# EAGLE design CP2102 breakout (EAGLE 7.3.0)
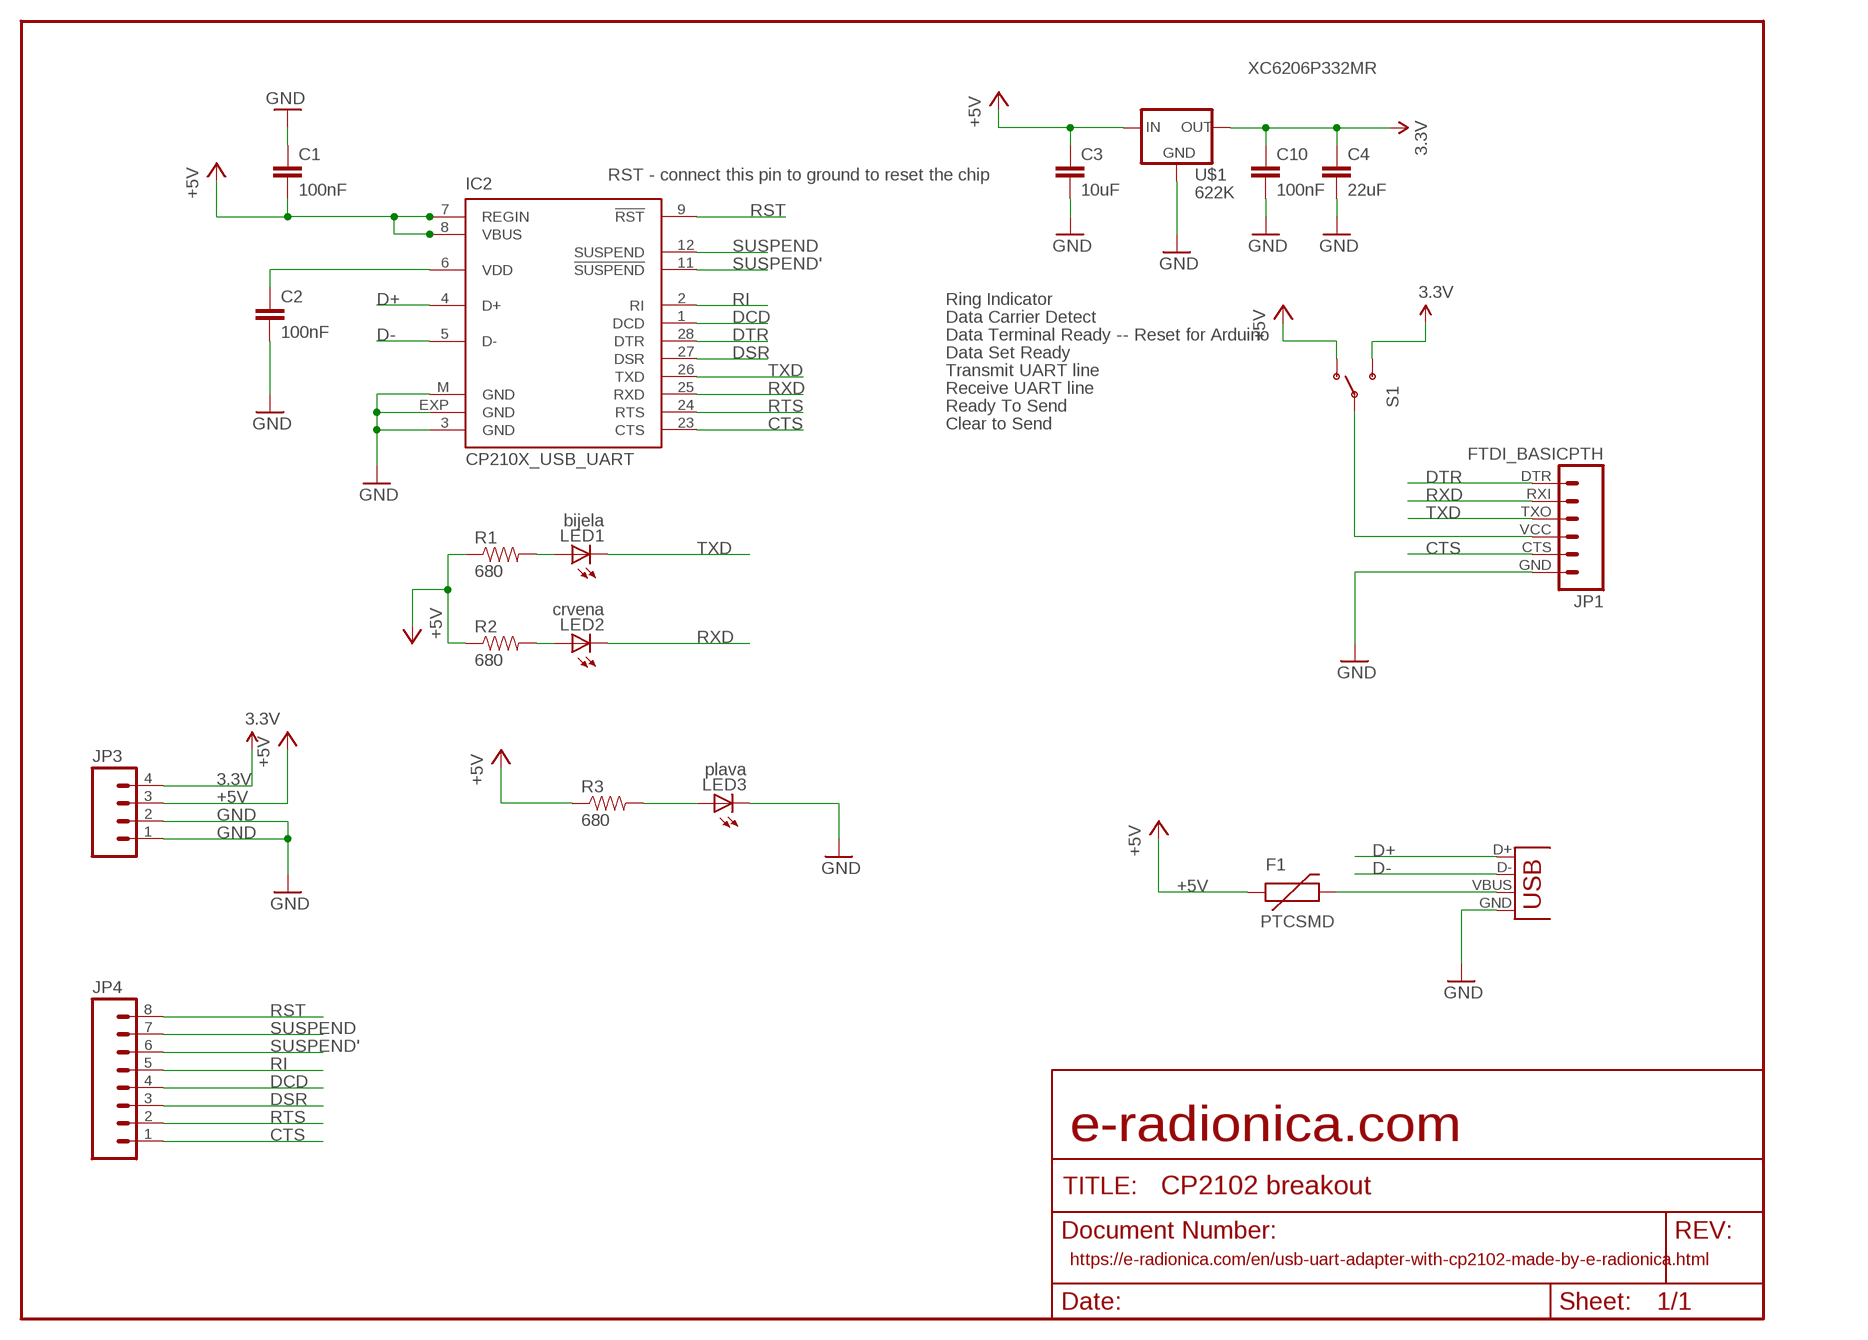
[diagram p0: schematic, sheet 1]

## Parts
C1  100nF  CAP0603-CAP  [0603-CAP]
C2  100nF  CAP0603-CAP  [0603-CAP]
C3  10uF  C-EUC3216  [C3216]
C4  22uF  C-EUC3216  [C3216]
C10  100nF  CAP0603-CAP  [0603-CAP]
F1  PTCSMD  [PTC-1206]
IC2  CP210X_USB_UART  [MLP28]
JP1  FTDI_BASICPTH  [FTDI_BASIC]
JP3  M04PTH  [1X04]
JP4  M081X08  [1X08]
LED1  bijela  LEDCHIP-LED0805  [CHIP-LED0805]
LED2  crvena  LEDCHIP-LED0805  [CHIP-LED0805]
LED3  plava  LEDCHIP-LED0805  [CHIP-LED0805]
R1  680  RESISTOR0603-RES  [0603-RES]
R2  680  RESISTOR0603-RES  [0603-RES]
R3  680  RESISTOR0603-RES  [0603-RES]
S1  SWITCH-SPST-SMD-A  [SWITCH-SPST-SMD-A]
U$1  622K  [662K]
X1  USB-MICROB  [USB-MICROB]

## Nets
3.3V: C4.1 C10.1 JP3.4 S1.3(S) U$1.OUT
+5V: C1.2 C3.1 F1.1 IC2.7(REGIN) IC2.8(VBUS) JP3.3 R1.1 R2.1 R3.1 S1.1(O) U$1.IN
CTS: IC2.23(CTS) JP1.CTS JP4.1
D+: IC2.4(D+) X1.D+
D-: IC2.5(D-) X1.D-
DCD: IC2.1(DCD) JP4.4
DSR: IC2.27(DSR) JP4.3
DTR: IC2.28(DTR) JP1.DTR
GND: C1.1 C2.2 C3.2 C4.2 C10.2 IC2.3(GND) IC2.EXP(GND) IC2.M(GND) JP1.GND JP3.1 JP3.2 LED3.C U$1.GND X1.GND
N$1: LED1.A R1.2
N$2: LED2.A R2.2
N$3: LED3.A R3.2
N$4: C2.1 IC2.6(VDD)
RI: IC2.2(RI) JP4.5
RST: IC2.9(!RST) JP4.8
RTS: IC2.24(RTS) JP4.2
RXD: IC2.25(RXD) JP1.RXI LED2.C
SUSPEND: IC2.12(SUSPEND) JP4.7
SUSPEND': IC2.11(!SUSPEND) JP4.6
TXD: IC2.26(TXD) JP1.TXO LED1.C
VBUS: F1.2 X1.VBUS
VCC: JP1.VCC S1.2(P)

## Notes on the sheet
- XC6206P332MR
- RST - connect this pin to ground to reset the chip
- Ring Indicator
- Data Carrier Detect
- Data Terminal Ready -- Reset for Arduino
- Data Set Ready
- Transmit UART line
- Receive UART line
- Ready To Send
- Clear to Send
- e-radionica.com
- https://e-radionica.com/en/usb-uart-adapter-with-cp2102-made-by-e-radionica.html

## Library data of the parts
C1 C2 C10 = SparkFun:CAP: Capacitor Standard 0603 ceramic capacitor, and 0.1" leaded capacitor.
C3 C4 = rcl:C-EU: CAPACITOR, European symbol
F1 = SparkFun:PTC: Resettable Fuse PTC Resettable Fuse. Spark Fun Electronics SKU : COM-08357
IC2 = SparkFun-DigitalIC:CP210X_USB_UART: Single-Chip USB to UART Bridge Source: www.silabs.com .. CP2101.pdf / cp2102.pdf. Spark Fun Electronics SKU : COM-00310
JP1 = SparkFun:FTDI_BASIC: FTDI Basic: 3.3V and 5V
JP3 = SparkFun:M04: Header 4 Standard 4-pin 0.1" header. Use with straight break away headers (SKU : PRT-00116), right angle break away headers (PRT-00553), swiss pins (PRT-00743), machine pins (PRT-00117), and female headers (PRT-00115). Molex polarized connector foot print use with SKU : PRT-08231 with associated crimp pins and housings. 1MM SMD Version SKU: PRT-10208
JP4 = SparkFun:M08: Header 8 Standard 8-pin 0.1" header. Use with straight break away headers (SKU : PRT-00116), right angle break away headers (PRT-00553), swiss pins (PRT-00743), machine pins (PRT-00117), and female headers (PRT-00115).
LED1-LED3 = adafruit:LED: LED OSRAM: - CHIPLED LG R971, LG N971, LY N971, LG Q971, LY Q971, LO R971, LY R971 LH N974, LH R974 LS Q976, LO Q976, LY Q976 LO Q996 - Hyper CHIPLED LW Q18S LB Q993, LB Q99A, LB R99A - SideLED LS A670, LO A670, LY A670, LG A670, LP A670 LB A673, LV A673, LT A673, LW A673 LH A674 LY A675 LS A676, LA A676, LO A676, LY A676, LW A676 LS A679, LY A679, LG A679 - Hyper Micro SIDELED® LS Y876, LA Y876, LO Y876, LY Y876 LT Y87S - SmartLED LW L88C, LW L88S LB L89C, LB L89S, LG L890 LS L89K, LO L89K, LY L89K LS L896, LA L896, LO L896, LY L896 - TOPLED LS T670, LO T670, LY T670, LG T670, LP T670 LSG T670, LSP T670, LSY T670, LOP T670, LYG T670 LG T671, LOG T671, LSG T671 LB T673, LV T673, LT T673, LW T673 LH T674 LS T676, LA T676, LO T676, LY T676, LB T676, LH T676, LSB T676, LW T676 LB T67C, LV T67C, LT T67C, LS T67K, LO T67K, LY T67K, LW E67C LS E67B, LA E67B, LO E67B, LY E67B, LB E67C, LV E67C, LT E67C LW T67C LS T679, LY T679, LG T679 LS T770, LO T770, LY T770, LG T770, LP T770 LB T773, LV T773, LT T773, LW T773 LH T774 LS E675, LA E675, LY E675, LS T675 LS T776, LA T776, LO T776, LY T776, LB T776 LHGB T686 LT T68C, LB T68C - Hyper Mini TOPLED® LB M676 - Mini TOPLED Santana® LG M470 LS M47K, LO M47K, LY M47K Source: http://www.osram.convergy.de/
R1-R3 = SparkFun:RESISTOR: Resistor Basic schematic elements and footprints for 0603, 1206, and PTH resistors.
S1 = SparkFun:SWITCH-SPST: SPST Switch Simple slide switch. Spark Fun Electronics SKU : COM-00102
U$1 = SparkFun:622K
X1 = SparkFun:USB: USB Connectors USB-B-PTH is fully proven SKU : PRT-00139 USB-miniB is fully proven SKU : PRT-00587 USB-A-PCB is untested. USB-A-H is throughly reviewed, but untested. Spark Fun Electronics SKU : PRT-00437 USB-B-SMT is throughly reviewed, but untested. Needs silkscreen touching up. USB-A-S has not been used/tested USB-MB-H has not been used/tested

## Board
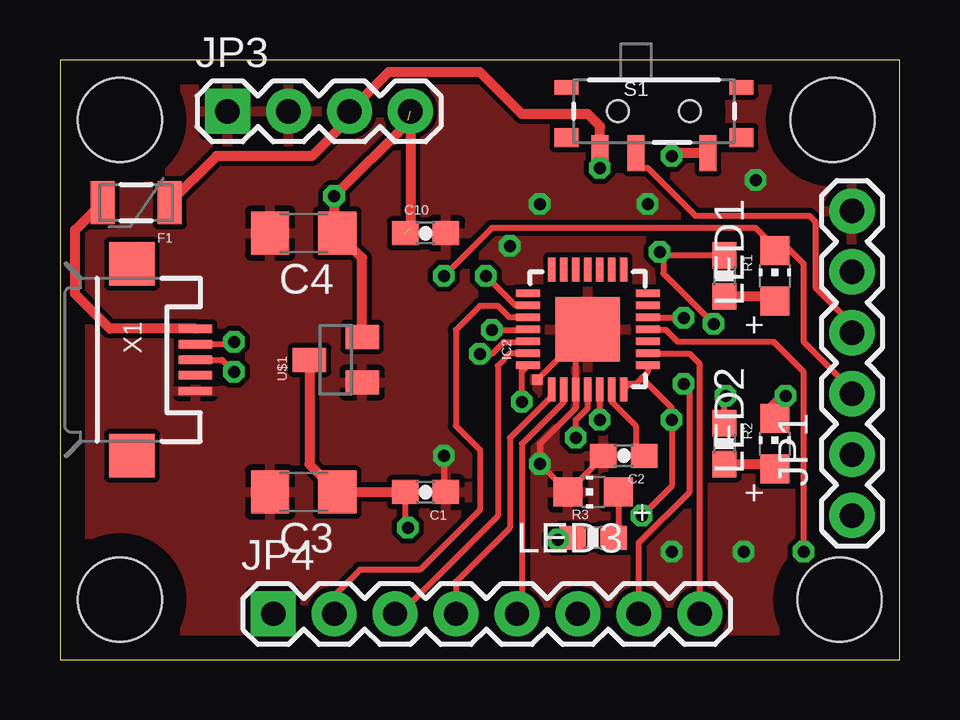
[diagram p1: board, top side]
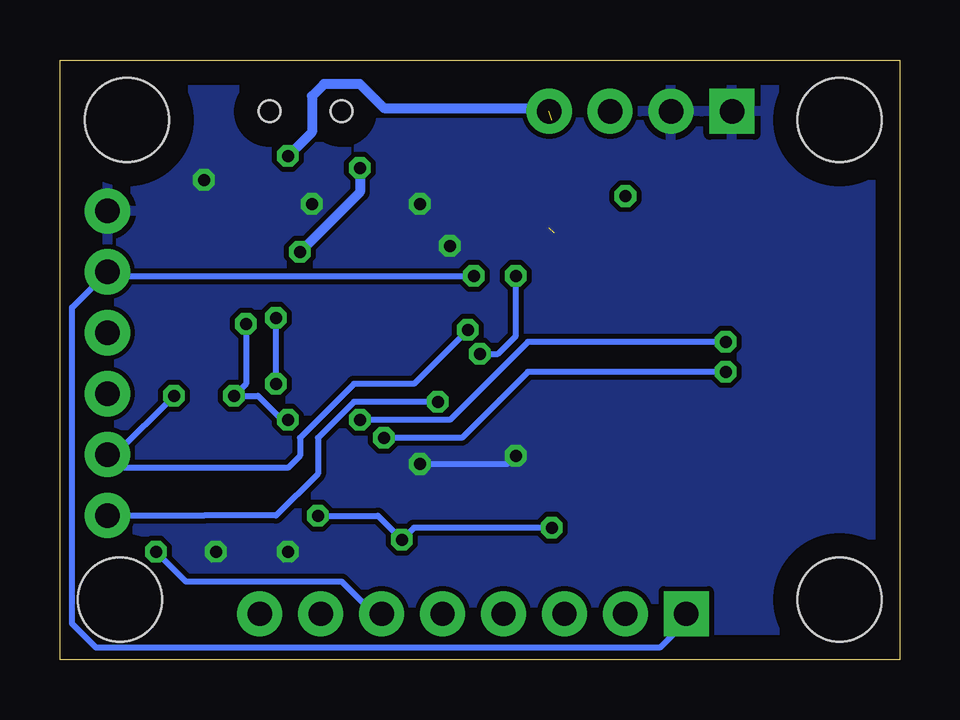
[diagram p2: board, bottom side, seen from below]

Size 35 x 25 mm. Coordinates in mm from the lower left corner, seen from the top.
Outline: 0,0 35,0 35,25 0,25 0,0
Copper layers (1*16): Top 0.035mm / dielectric 1.5mm / Bottom 0.035mm
Design rules "default *": minimum track width 10mil, minimum drill 24mil, track to track 8mil, track to pad 8mil, pad to pad 8mil, via to via 8mil, smd to smd 8mil, copper to edge 40mil, drill to drill 8mil, minimum pad ring 10mil, minimum via ring 8mil, stop-mask expansion 4mil, vias tented up to drill 5mm, thermal gap 10mil
Holes 3.5 mm at 2.5,2.5 32.2,22.5 32.5,2.5 2.5,22.5

### Footprints (pad centres in the part's own frame; a part is rotated, then mirrored left to right if it is on the bottom)
0603-CAP = smd 1.1 x 1: 1 -0.85,0; 2 0.85,0
C3216 = smd 1.6 x 1.8: 1 -1.4,0; 2 1.4,0
PTC-1206 = smd 1 x 1.8: 1 -1.4,0; 2 1.4,0
MLP28 = smd 1 x 0.3: 1 -2.5,1.5; 2 -2.5,1; 3 -2.5,0.5; 4 -2.5,0; 5 -2.5,-0.5; 6 -2.5,-1; 7 -2.5,-1.5; 15 2.5,-1.5; 16 2.5,-1; 17 2.5,-0.5; 18 2.5,0; 19 2.5,0.5; 20 2.5,1; 21 2.5,1.5 | smd 0.3 x 1: 8 -1.5,-2.5; 9 -1,-2.5; 10 -0.5,-2.5; 11 0,-2.5; 12 0.5,-2.5; 13 1,-2.5; 14 1.5,-2.5; 22 1.5,2.5; 23 1,2.5; 24 0.5,2.5; 25 0,2.5; 26 -0.5,2.5; 27 -1,2.5; 28 -1.5,2.5 | smd 2.7 x 2.7: EXP 0,0 | smd 0.435 x 0.435: M -2.103,2.103
FTDI_BASIC = drill 1.016 pad 1.88: CTS 10.16,0; DTR 0,0; GND 12.7,0; RXI 2.54,0; TXO 5.08,0; VCC 7.62,0
1X04 = drill 1.016 pad 1.88 square: 1 0,0 | drill 1.016 pad 1.88: 2 2.54,0; 3 5.08,0; 4 7.62,0
1X08 = drill 1.016 pad 1.88 square: 1 0,0 | drill 1.016 pad 1.88: 2 2.54,0; 3 5.08,0; 4 7.62,0; 5 10.16,0; 6 12.7,0; 7 15.24,0; 8 17.78,0
CHIP-LED0805 = smd 1.2 x 1.2: A 0,-1.05; C 0,1.05
0603-RES = smd 1.1 x 1: 1 -0.85,0; 2 0.85,0
SWITCH-SPST-SMD-A = smd 0.7 x 1.5: 1 -2.25,-1.75; 2 -0.75,-1.75; 3 2.25,-1.75 | smd 1 x 0.6: GND1 -3.65,1; GND3 3.65,1 | smd 1 x 0.8: GND2 -3.65,-1.1; GND4 3.65,-1.1 | hole 0.9: -1.5,0; 1.5,0
662K = smd 1 x 1.4: GND -0.95,-1.1; IN 0,1.1; OUT 0.95,-1.1
USB-MICROB = smd 0.35 x 1.4: D+ 0,2.65; D- -0.65,2.65; GND 1.3,2.65; ID 0.65,2.65; VBUS -1.3,2.65 | smd 1.8 x 1.9: MT1 -4,0; MT2 4,0

### Placement (x,y rotation side)
C1  15.24,6.99 180 top
C2  23.5,8.5 180 top
C3  10.16,6.99 180 top
C4  10.16,17.78 180 top
C10  15.24,17.78 0 top
F1  3.17,19.05 180 top
IC2  22,13.77 90 top
JP1  33.02,6 90 top
JP3  6.99,22.86 0 top
JP4  8.89,1.91 0 top
LED1  29.8,16 0 top
LED2  29.8,9 0 top
LED3  22.23,6.99 90 top
R1  27.7,16 270 top
R2  27.7,9 270 top
R3  22.23,5.08 0 top
S1  24.77,22.86 0 top
U$1  11.5,12.5 90 top
U$2  [OSH3MM]  7.5,13.5 0 top
U$3  [NOVI_LOGO-4MM]  16.25,19.25 0 top
U$4  [LUDI_LOGO_BACK]  5,8 0 top
U$5  [E-RADIONICA.COM_MADE_IN_BACK!]  4.75,5.5 0 top
X1  3,12.5 270 top

### Tracks (layer width: path | path; a pad name or v marks a point on that pad's centre or on a via)
3.3V  (via drill 0.5)  (2 unrouted)
  Top 0.406: JP3.4 14.61,18 | S1.3 25.61,21.11 v25.5,21 | U$1.OUT 12.6,16.74 C4.1 11.43,17.91 v11.43,19.32 14.5,22.39 14.5,22.5
  Bottom 0.406: JP3.4 14.74,23 21.5,23 22.5,24 24,24 24.5,23.5 24.5,22 v25.5,21
+5V  (via drill 0.5)
  Top 0.254: IC2.8 24.5,12 24.25,11.75 | 24.25,11.75 24,11.5 23.73,11.5 IC2.7 | C1.2 14.39,5.61 v14.5,5.5 | v20.75,5 21.3,5 R3.1 | R2.1 27.7,10.95 v27.75,11 | 24.25,11.75 25.5,10.5 v25.5,10 25.5,7.25 v24.25,6 | R1.1 25.15,16.85 | 25.15,16.85 v25,17 | v22.5,20.5 22.5,21.09 S1.1 | 25.15,16.85 25.15,16.1 v27.25,14
  Top 0.406: F1.1 6.53,21 10.5,21 12.06,22.57 JP3.3 13.71,24.5 17.5,24.5 19.25,22.75 22,22.75 22.52,22.23 S1.1 | C1.2 C3.1 10.4,8.14 U$1.IN
  Bottom 0.254: v25.5,10 25.75,10 26.75,11 v27.75,11 27.25,11.5 v27.25,14 | v14.5,5.5 20.25,5.5 v20.75,5 21.75,6 v24.25,6
  Bottom 0.406: v22.5,20.5 22.5,19.5 v25,17
CTS  (via drill 0.5)
  Top 0.254: 19.48,14.75 IC2.23 18.98,14.77 v17.75,16
  Bottom 0.254: v17.75,16 32.25,16 32.41,16.16 JP1.CTS 34.5,14.69 34.5,1.5 33.5,0.5 10,0.5 8.89,1.61 JP4.1
D+  (via drill 0.5)
  Top 0.254: X1.D+ 6.75,12.5 v7.25,12 | v21.5,9.25 21.5,10 22,10.5 IC2.4
  Bottom 0.254: v7.25,12 15.5,12 18.25,9.25 v21.5,9.25
D-  (via drill 0.5)
  Top 0.254: X1.D- 7.15,13.15 v7.25,13.25 | v22.5,10 IC2.5
  Bottom 0.254: v7.25,13.25 15.5,13.25 18.75,10 v22.5,10
DCD
  Top 0.254: IC2.1 20.5,11 18.75,9.25 18.75,5.5 16.5,3.25 JP4.4
DSR
  Top 0.254: IC2.27 18.77,12.77 18.25,12.25 18.25,6 14.5,2.25 14.31,2.25 JP4.3
DTR  (via drill 0.5)
  Top 0.254: 19.48,12.25 IC2.28 19.25,12.02 v19.25,10.75
  Bottom 0.254: v19.25,10.75 22.75,10.75 24.25,9.25 24.25,7.75 26,6 29,6 | 28.99,6 29,6 | JP1.DTR 29,6
GND  (via drill 0.5)
  Top 0.254: IC2.EXP 22,12.75 | IC2.M IC2.EXP | v16,8.5 16,7.08 C1.1 | IC2.EXP 21.5,13.27 IC2.3 21.5,10.5 20,9 v20,8.16 LED3.C 22.65,8.46 C2.2
  Bottom 0.254: v20,8.16 16.34,8.16 v16,8.5
  other vias: 28.5,4.5 25.5,4.5 29,20 18.75,17.25 24.5,19 20,19
  pour Top: 0,0 35,0 35,25 0,25
  pour Bottom: 0,0 35,0 35,25 0,25
N$1
  Top 0.406: R1.2 29.6,15.15 LED1.A
N$2
  Top 0.406: R2.2 29.6,8.15 LED2.A
N$3
  Top 0.254: LED3.A 23.27,5.28 R3.2
N$4
  Top 0.254: IC2.6 23,10.75 24,9.75 24,8.85 C2.1
RI
  Top 0.254: IC2.2 21,10.75 19.25,9 19.25,2.1 JP4.5
RST
  Top 0.254: JP4.8 26.67,12.33 26.25,12.75 24.52,12.75 IC2.9
RTS
  Top 0.254: IC2.24 18.73,14.27 18.25,14.75 17.5,14.75 16.5,13.75 16.5,9.75 17.5,8.75 17.5,6.25 15,3.75 12.5,3.75 11.25,2.5 11.25,2.08 JP4.2
RXD  (via drill 0.5)
  Top 0.254: v18,13.75 19.48,13.75 IC2.25 | v30.25,11 30,11 29.5,10.5 29.5,10.35 LED2.C
  Bottom 0.254: v30.25,11 32.7,8.54 JP1.RXI 32.48,8 25.5,8 25,8.5 25,9.25 22.75,11.5 20.25,11.5 v18,13.75
SUSPEND  (via drill 0.5)
  Top 0.254: JP4.7 24.13,4.88 26.25,7 26.25,11.25 v26,11.5 | v26,14.25 24.52,14.25 IC2.12
  Bottom 0.254: v26,11.5 v26,14.25
SUSPEND'  (via drill 0.5)
  Top 0.254: v31,4.5 31,12 29.75,13.25 25.75,13.25 25.25,13.75 24.52,13.75 IC2.11
  Bottom 0.254: JP4.6 21.91,1.91 23.25,3.25 29.75,3.25 v31,4.5
TXD  (via drill 0.5)
  Top 0.254: JP1.TXO 33.02,11.23 31,13.25 31,16.5 30.5,17 | 30.5,17 29.85,17 LED1.C 30.45,17.05 | 30.45,17.05 30.5,17 | 30.45,17.05 30,17.5 29.5,17.5 29,18 18,18 v16,16 | v17.5,12.75 18,12.75 18.5,13.25 19.48,13.25 IC2.26
  Bottom 0.254: v17.5,12.75 16.75,12.75 16,13.5 v16,16
VBUS
  Top 0.406: X1.VBUS 2.08,13.8 0.64,15.24 0.64,17.91 F1.2
VCC
  Top 0.254: JP1.VCC 33.02,13.98 31.5,15.5 31.5,18.25 31.25,18.5 26.5,18.5 24.5,20.5 24,20.5 24,21.09 S1.2

### Text on the board
200bmp: 5V | 3V3 | GND | TX | CTS | VCC | TX | RX | RX | DTR
208bmp: output voltage switch | GND | GND | 5V | 3V3 | 5V | 3.3V | GND | CTS | VCC | TX | CP2102 USB / to UART bridge | RX | DTR | CTS | RTS | DSR | DCD | RI | SUSPEND | RST | SUSPEND'